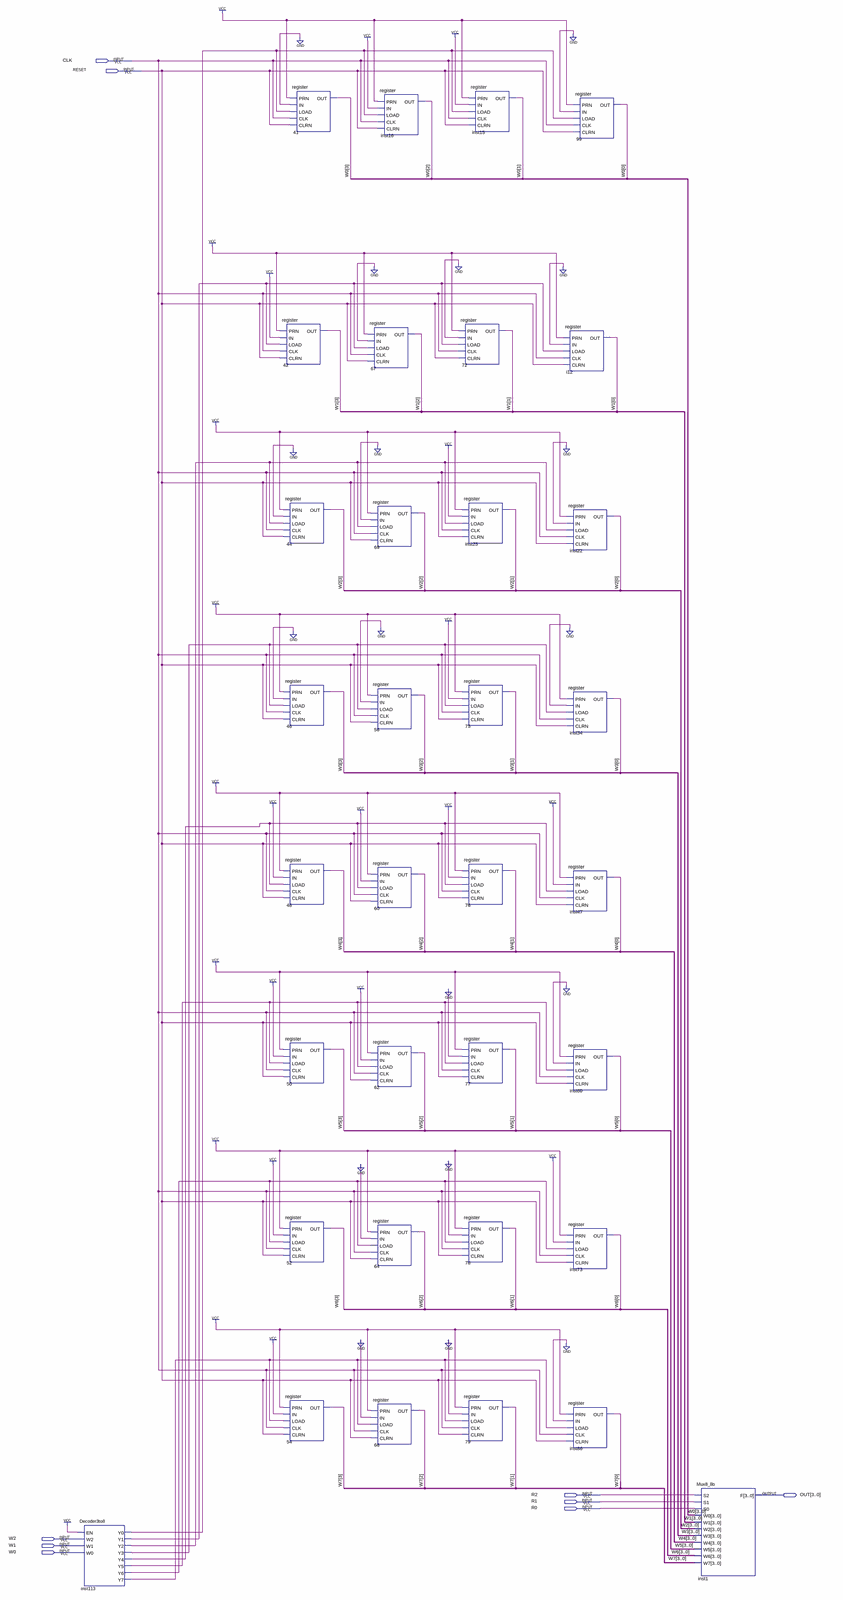
[diagram p0: schematic sheet, whole]
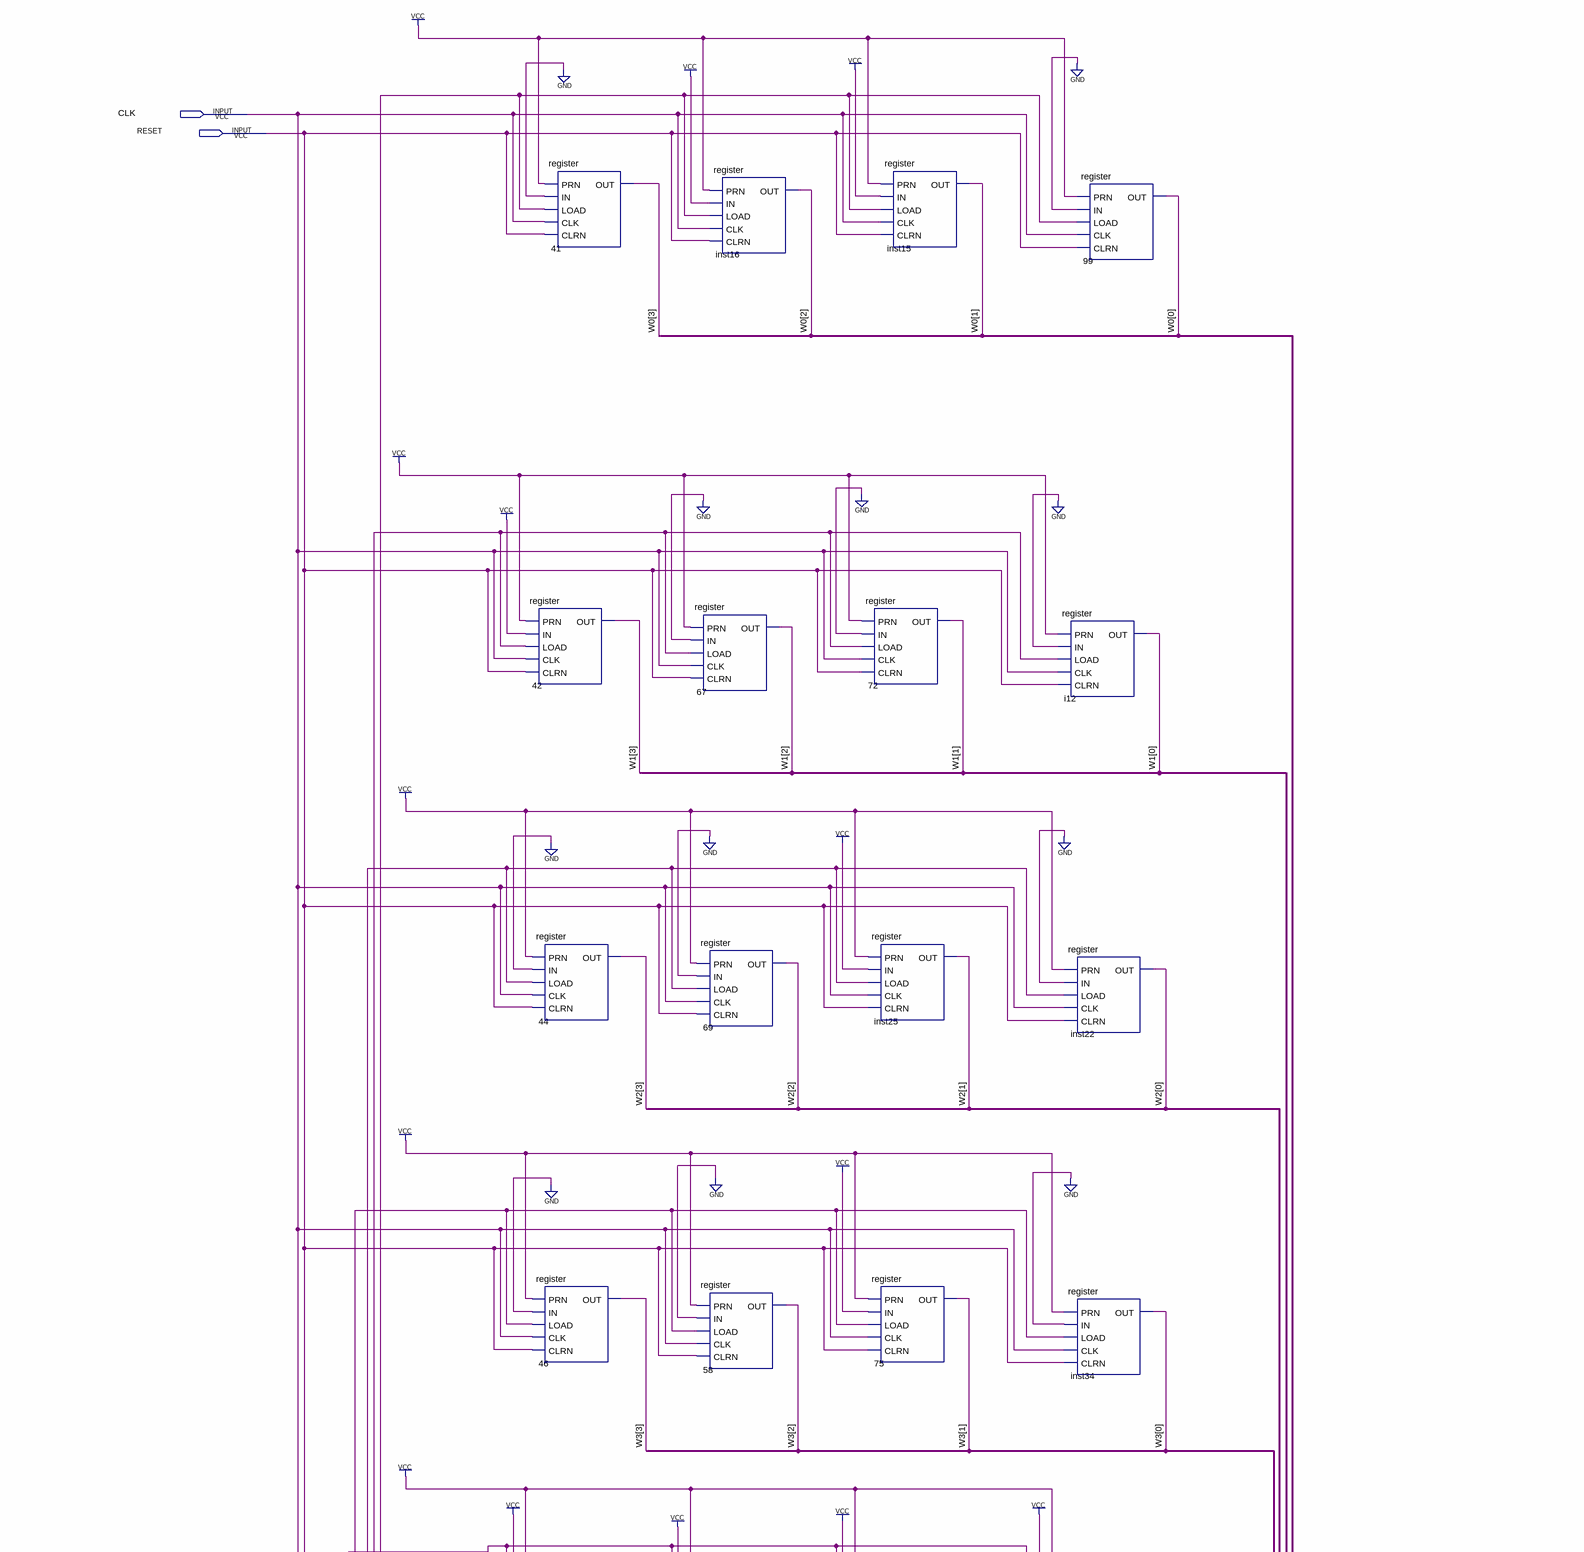
[diagram p1: schematic sheet, upper part]
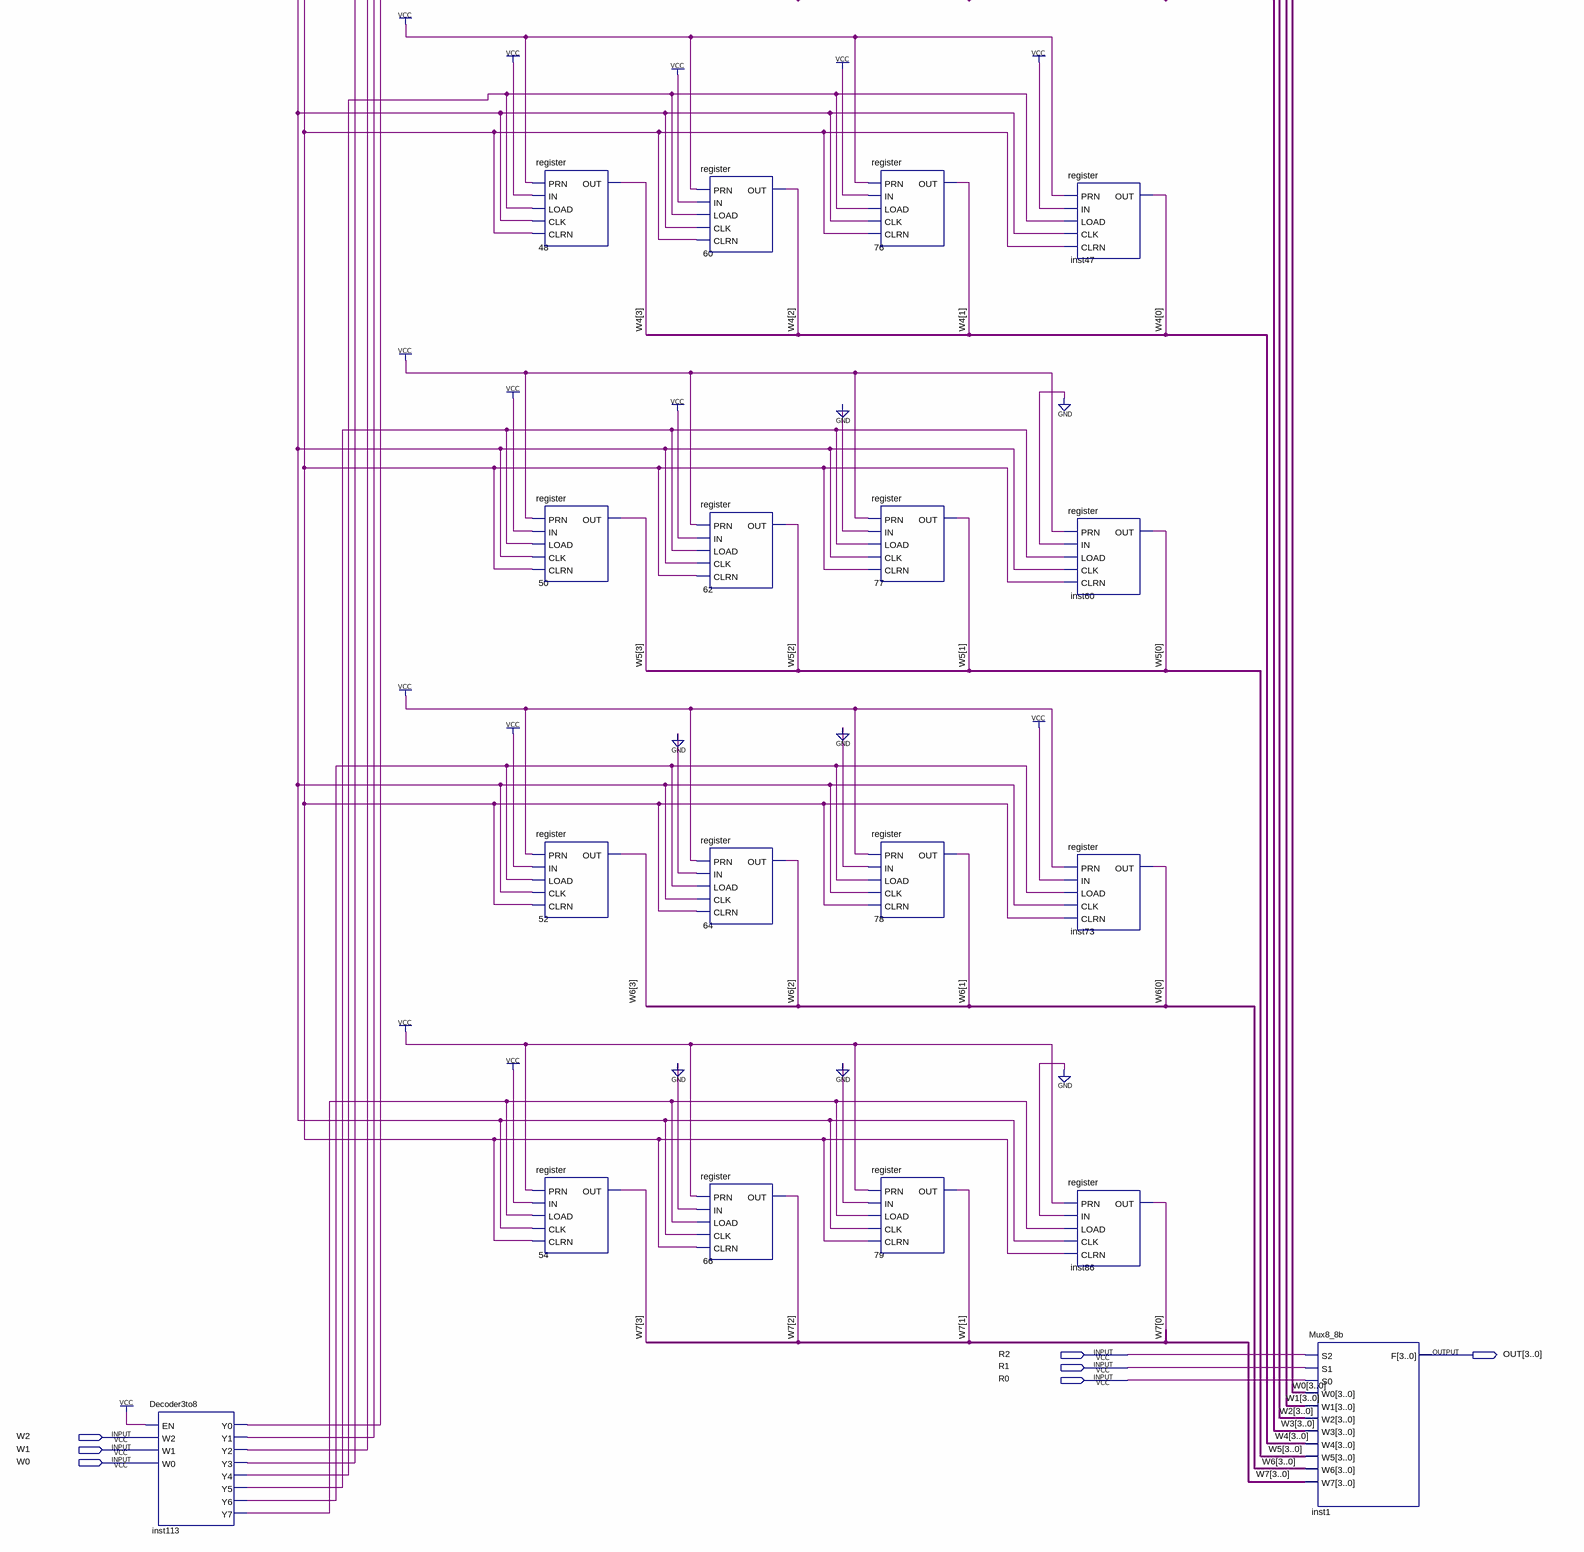
[diagram p2: schematic sheet, lower part]
// Quartus schematic itemprice.bdf as structural Verilog: 34 symbols, 9 pins
module itemprice (
  input  CLK,
  input  RESET,
  input  R2,
  input  R1,
  input  R0,
  input  W2,
  input  W1,
  input  W0,
  output [3:0] OUT
);

  wire inst113_y0, inst113_y1, inst113_y2, inst113_y3, inst113_y4, inst113_y5, inst113_y6, inst113_y7;
  wire [3:0] W0_bus, W1_bus, W2_bus, W3, W4, W5, W6, W7;

  Decoder3to8 inst113 (
    .EN(1'b1), .W2(W2), .W1(W1), .W0(W0), .Y0(inst113_y0), .Y1(inst113_y1), .Y2(inst113_y2), .Y3(inst113_y3),
    .Y4(inst113_y4), .Y5(inst113_y5), .Y6(inst113_y6), .Y7(inst113_y7));
  register u_41 (.PRN(1'b1), .IN(1'b0), .LOAD(inst113_y0), .CLK(CLK), .CLRN(RESET), .OUT(W0_bus[3]));
  register u_42 (.PRN(1'b1), .IN(1'b1), .LOAD(inst113_y1), .CLK(CLK), .CLRN(RESET), .OUT(W1_bus[3]));
  register u_44 (.PRN(1'b1), .IN(1'b0), .LOAD(inst113_y2), .CLK(CLK), .CLRN(RESET), .OUT(W2_bus[3]));
  register u_46 (.PRN(1'b1), .IN(1'b0), .LOAD(inst113_y3), .CLK(CLK), .CLRN(RESET), .OUT(W3[3]));
  register u_48 (.PRN(1'b1), .IN(1'b1), .LOAD(inst113_y4), .CLK(CLK), .CLRN(RESET), .OUT(W4[3]));
  register u_50 (.PRN(1'b1), .IN(1'b1), .LOAD(inst113_y5), .CLK(CLK), .CLRN(RESET), .OUT(W5[3]));
  register u_52 (.PRN(1'b1), .IN(1'b1), .LOAD(inst113_y6), .CLK(CLK), .CLRN(RESET), .OUT(W6[3]));
  register u_54 (.PRN(1'b1), .IN(1'b1), .LOAD(inst113_y7), .CLK(CLK), .CLRN(RESET), .OUT(W7[3]));
  register inst16 (.PRN(1'b1), .IN(1'b1), .LOAD(inst113_y0), .CLK(CLK), .CLRN(RESET), .OUT(W0_bus[2]));
  register u_67 (.PRN(1'b1), .IN(1'b0), .LOAD(inst113_y1), .CLK(CLK), .CLRN(RESET), .OUT(W1_bus[2]));
  register u_69 (.PRN(1'b1), .IN(1'b0), .LOAD(inst113_y2), .CLK(CLK), .CLRN(RESET), .OUT(W2_bus[2]));
  register u_58 (.PRN(1'b1), .IN(1'b0), .LOAD(inst113_y3), .CLK(CLK), .CLRN(RESET), .OUT(W3[2]));
  register u_60 (.PRN(1'b1), .IN(1'b1), .LOAD(inst113_y4), .CLK(CLK), .CLRN(RESET), .OUT(W4[2]));
  register u_62 (.PRN(1'b1), .IN(1'b1), .LOAD(inst113_y5), .CLK(CLK), .CLRN(RESET), .OUT(W5[2]));
  register u_64 (.PRN(1'b1), .IN(1'b0), .LOAD(inst113_y6), .CLK(CLK), .CLRN(RESET), .OUT(W6[2]));
  register u_66 (.PRN(1'b1), .IN(1'b0), .LOAD(inst113_y7), .CLK(CLK), .CLRN(RESET), .OUT(W7[2]));
  register u_72 (.PRN(1'b1), .IN(1'b0), .LOAD(inst113_y1), .CLK(CLK), .CLRN(RESET), .OUT(W1_bus[1]));
  register inst25 (.PRN(1'b1), .IN(1'b1), .LOAD(inst113_y2), .CLK(CLK), .CLRN(RESET), .OUT(W2_bus[1]));
  register u_75 (.PRN(1'b1), .IN(1'b1), .LOAD(inst113_y3), .CLK(CLK), .CLRN(RESET), .OUT(W3[1]));
  register u_76 (.PRN(1'b1), .IN(1'b1), .LOAD(inst113_y4), .CLK(CLK), .CLRN(RESET), .OUT(W4[1]));
  register u_77 (.PRN(1'b1), .IN(1'b0), .LOAD(inst113_y5), .CLK(CLK), .CLRN(RESET), .OUT(W5[1]));
  register u_78 (.PRN(1'b1), .IN(1'b0), .LOAD(inst113_y6), .CLK(CLK), .CLRN(RESET), .OUT(W6[1]));
  register u_79 (.PRN(1'b1), .IN(1'b0), .LOAD(inst113_y7), .CLK(CLK), .CLRN(RESET), .OUT(W7[1]));
  register inst15 (.PRN(1'b1), .IN(1'b1), .LOAD(inst113_y0), .CLK(CLK), .CLRN(RESET), .OUT(W0_bus[1]));
  register i12 (.PRN(1'b1), .IN(1'b0), .LOAD(inst113_y1), .CLK(CLK), .CLRN(RESET), .OUT(W1_bus[0]));
  register inst22 (.PRN(1'b1), .IN(1'b0), .LOAD(inst113_y2), .CLK(CLK), .CLRN(RESET), .OUT(W2_bus[0]));
  register inst34 (.PRN(1'b1), .IN(1'b0), .LOAD(inst113_y3), .CLK(CLK), .CLRN(RESET), .OUT(W3[0]));
  register inst47 (.PRN(1'b1), .IN(1'b1), .LOAD(inst113_y4), .CLK(CLK), .CLRN(RESET), .OUT(W4[0]));
  register inst60 (.PRN(1'b1), .IN(1'b0), .LOAD(inst113_y5), .CLK(CLK), .CLRN(RESET), .OUT(W5[0]));
  register inst73 (.PRN(1'b1), .IN(1'b1), .LOAD(inst113_y6), .CLK(CLK), .CLRN(RESET), .OUT(W6[0]));
  register inst86 (.PRN(1'b1), .IN(1'b0), .LOAD(inst113_y7), .CLK(CLK), .CLRN(RESET), .OUT(W7[0]));
  register u_99 (.PRN(1'b1), .IN(1'b0), .LOAD(inst113_y0), .CLK(CLK), .CLRN(RESET), .OUT(W0_bus[0]));
  Mux8_8b inst1 (
    .S2(R2), .S1(R1), .S0(R0), .W0(W0_bus), .W1(W1_bus), .W2(W2_bus), .W3(W3), .W4(W4), .W5(W5), .W6(W6),
    .W7(W7), .F(OUT));
endmodule
